# EAGLE design IRRemoteWand (EAGLE 7.6.0)

## Sheet 1 of 2
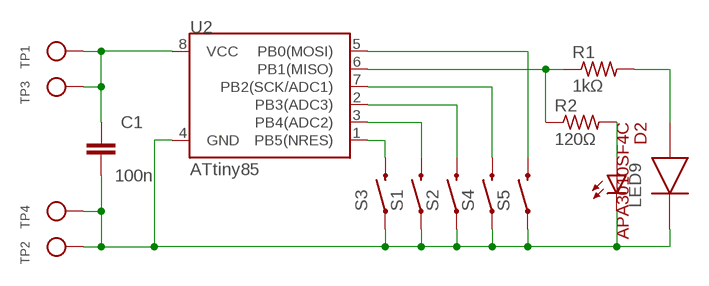
[diagram p0: schematic, sheet 1]

### Parts
C1  100n  CAP0603-CAP  [0603-CAP]
D2  APA3010SF4C  [APA3010SF4C]
LED9  LEDCHIPLED_0805  [CHIPLED_0805]
R1  1kΩ  R-US_M0805  [M0805]
R2  120Ω  R-US_M0805  [M0805]
S1  SWITCH-MOMENTARY-2SMD-4  [TACTILE_SWITCH_TALL]
S2  SWITCH-MOMENTARY-2SMD-4  [TACTILE_SWITCH_TALL]
S3  SWITCH-MOMENTARY-2SMD-4  [TACTILE_SWITCH_TALL]
S4  SWITCH-MOMENTARY-2SMD-4  [TACTILE_SWITCH_TALL]
S5  SWITCH-MOMENTARY-2SMD-4  [TACTILE_SWITCH_TALL]
TP1  TESTPOINTPAD  [TESTPOINT_PAD_2MM]
TP2  TESTPOINTPAD  [TESTPOINT_PAD_2MM]
TP3  TESTPOINTPAD  [TESTPOINT_PAD_2MM]
TP4  TESTPOINTPAD  [TESTPOINT_PAD_2MM]
U2  ATtiny85  ATTINY45TINY45-20-SMT  [SO08-EIAJ]

### Nets
GND: C1.2 D2.2 LED9.C S1.A2 S2.A2 S3.A2 S4.A2 S5.A2 TP2.P$1 TP4.P$1 U2.4(GND)
N$1: R1.1 R2.1 U2.6(PB1(MISO))
N$3: S3.B2 U2.1(PB5(NRES))
N$4: S1.B2 U2.3(PB4(ADC2))
N$5: S2.B2 U2.2(PB3(ADC3))
N$6: S4.B2 U2.7(PB2(SCK/ADC1))
N$7: D2.1 R1.2
N$8: S5.B2 U2.5(PB0(MOSI))
N$9: C1.1 TP1.P$1 TP3.P$1 U2.8(VCC)
N$10: LED9.A R2.2

## Sheet 2 of 2

## Library data of the parts
C1 = SparkFun-Capacitors:CAP: Capacitor Standard 0603 ceramic capacitor, and 0.1" leaded capacitor.
D2 = SparkFun-LED:APA3010SF4C: DIO-10854 Right-angle 880nm SMT infrared LED; PROD_ID: DIO-10854
LED9 = adafruit:LED: LED OSRAM: - CHIPLED LG R971, LG N971, LY N971, LG Q971, LY Q971, LO R971, LY R971 LH N974, LH R974 LS Q976, LO Q976, LY Q976 LO Q996 - Hyper CHIPLED LW Q18S LB Q993, LB Q99A, LB R99A - SideLED LS A670, LO A670, LY A670, LG A670, LP A670 LB A673, LV A673, LT A673, LW A673 LH A674 LY A675 LS A676, LA A676, LO A676, LY A676, LW A676 LS A679, LY A679, LG A679 - Hyper Micro SIDELED® LS Y876, LA Y876, LO Y876, LY Y876 LT Y87S - SmartLED LW L88C, LW L88S LB L89C, LB L89S, LG L890 LS L89K, LO L89K, LY L89K LS L896, LA L896, LO L896, LY L896 - TOPLED LS T670, LO T670, LY T670, LG T670, LP T670 LSG T670, LSP T670, LSY T670, LOP T670, LYG T670 LG T671, LOG T671, LSG T671 LB T673, LV T673, LT T673, LW T673 LH T674 LS T676, LA T676, LO T676, LY T676, LB T676, LH T676, LSB T676, LW T676 LB T67C, LV T67C, LT T67C, LS T67K, LO T67K, LY T67K, LW E67C LS E67B, LA E67B, LO E67B, LY E67B, LB E67C, LV E67C, LT E67C LW T67C LS T679, LY T679, LG T679 LS T770, LO T770, LY T770, LG T770, LP T770 LB T773, LV T773, LT T773, LW T773 LH T774 LS E675, LA E675, LY E675, LS T675 LS T776, LA T776, LO T776, LY T776, LB T776 LHGB T686 LT T68C, LB T68C - Hyper Mini TOPLED® LB M676 - Mini TOPLED Santana® LG M470 LS M47K, LO M47K, LY M47K Source: http://www.osram.convergy.de/
R1 R2 = adafruit:R-US_: RESISTOR, American symbol
S1-S5 = SparkFun-Electromechanical:SWITCH-MOMENTARY-2: Various NO switches- pushbuttons, reed, etc; PROD_ID: SWCH-11966
TP1-TP4 = microbuilder:TESTPOINT: Test Point Various test points for characterisation and PCB testing TESTPOINT_SMT - Compact Surface Mount Test Point [Digikey: 5016KTR-ND]
U2 = SparkFun-DigitalIC:ATTINY45: Atmel 8-pin 2/4/8kB flash uC; PROD_ID: IC-08922; VALUE: Tiny45-20-SMT

## Board
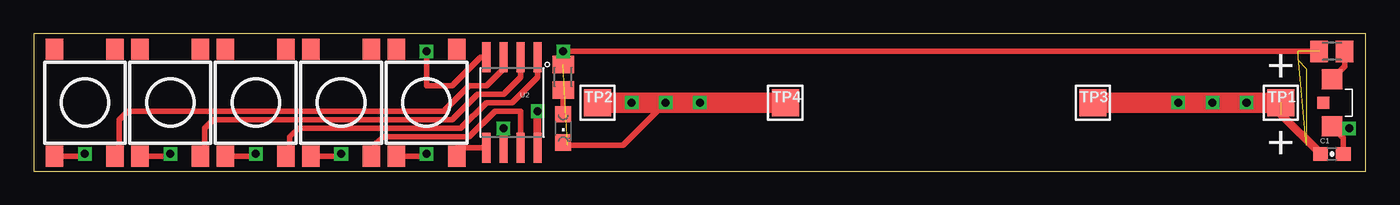
[diagram p1: board, top side]
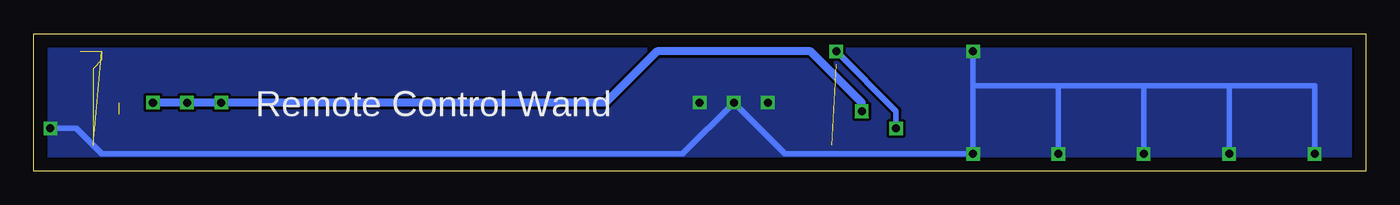
[diagram p2: board, bottom side, seen from below]

Size 99.04 x 10.21 mm. Coordinates in mm from the lower left corner, seen from the top.
Outline: 0,0 99.04,0 99.04,10.21 0,10.21 0,0
Copper layers (1*16): Top 0.035mm / dielectric 1.5mm / Bottom 0.035mm
Design rules "default": minimum track width 10mil, minimum drill 24mil, track to track 8mil, track to pad 8mil, pad to pad 8mil, via to via 8mil, smd to smd 8mil, copper to edge 40mil, drill to drill 8mil, minimum pad ring 10mil, minimum via ring 8mil, stop-mask expansion 4mil, vias tented up to drill 0mil, thermal gap 10mil

### Footprints (pad centres in the part's own frame; a part is rotated, then mirrored left to right if it is on the bottom)
0603-CAP = smd 1.1 x 1: 1 -0.85,0; 2 0.85,0
APA3010SF4C = smd 1.5 x 1.5: 1 0,-1.75; 2 0,1.75 | smd 0.9 x 0.9: 3 0.65,0
CHIPLED_0805 = smd 1.2 x 1.2: A 0,-1.05; C 0,1.05
M0805 = smd 1.3 x 1.6: 1 -0.95,0; 2 0.95,0
TACTILE_SWITCH_TALL = smd 1.55 x 1.3: A1 -3.975,-2.25; A2 3.975,-2.25; B1 -3.975,2.25; B2 3.975,2.25
TESTPOINT_PAD_2MM = smd 2 x 2: P$1 0,0
SO08-EIAJ = smd 0.61 x 2.21: 1 -1.905,-3.378; 2 -0.635,-3.378; 3 0.635,-3.378; 4 1.905,-3.378; 5 1.905,3.353; 6 0.635,3.353; 7 -0.635,3.353; 8 -1.905,3.353

### Placement (x,y rotation side)
C1  96.52,1.27 0 top
D2  96.52,5.08 180 top
LED9  39.37,3.17 180 top
R1  96.52,8.89 0 top
R2  39.37,6.99 270 top
S1  3.81,5.08 270 top
S2  10.16,5.08 270 top
S3  16.51,5.08 270 top
S4  22.86,5.08 270 top
S5  29.21,5.08 270 top
TP1  92.71,5.08 0 top
TP2  41.91,5.08 0 top
TP3  78.74,5.08 0 top
TP4  55.88,5.08 0 top
U2  35.56,5.08 180 top

### Tracks (layer width: path | path; a pad name or v marks a point on that pad's centre or on a via)
GND  (via drill 0.6)
  Top 0.406: S4.A2 22.7,1.1 v22.86,1.27 | S3.A2 16.34,1.1 v16.51,1.27 | S2.A2 9.99,1.1 v10.16,1.27 | S1.A2 3.65,1.1 v3.81,1.27 | U2.4 33.22,8.46 31.11,6.35 29.21,6.35 v29.21,8.89 | 39.37,2.54 LED9.C 39.59,1.91 43.81,1.91 v46.99,5.08 | S5.A2 29.05,1.1 v29.21,1.27 | D2.2 97.37,2.48 C1.2 | D2.2 96.52,3.81 | D2.2 96.52,3.17 v97.79,3.17
  Top 1.524: TP2.P$1 v44.45,5.08 v46.99,5.08 v49.53,5.08 TP4.P$1
  Bottom 0.406: v22.86,1.27 22.86,6.35 | 22.86,6.35 29.21,6.35 | v16.51,1.27 16.51,6.35 | 16.51,6.35 22.86,6.35 | v10.16,1.27 10.16,6.35 | 10.16,6.35 16.51,6.35 | v3.81,1.27 3.81,6.35 10.16,6.35 | v29.21,8.89 29.21,6.35 | 29.21,6.35 v29.21,1.27 43.18,1.27 v46.99,5.08 50.8,1.27 93.98,1.27 95.89,3.17 v97.79,3.17
  pour Bottom: 0,10.16 99.06,10.16 99.06,0 0,0
N$1  (via drill 0.6)  (6 unrouted)
  Top 0.406: U2.6 v34.92,3.17 | R2.1 v39.37,8.89 R1.1
  Bottom 0.406: v34.92,3.17 34.92,4.45 v39.37,8.89
N$3
  Top 0.406: U2.1 37.47,6.99 35.56,5.08 33.66,5.08 31.75,3.17 19.68,3.17 19.05,2.54 19.05,1.4 S3.B2
N$4
  Top 0.406: U2.3 34.92,7.62 33.66,6.35 32.38,6.35 30.48,4.45 6.99,4.45 6.35,3.81 6.35,1.4 S1.B2
N$5
  Top 0.406: U2.2 36.2,6.99 34.92,5.71 33.02,5.71 31.11,3.81 13.34,3.81 12.7,3.17 12.7,1.4 S2.B2
N$6
  Top 0.406: U2.7 36.2,4.45 34.29,4.45 32.38,2.54 26.04,2.54 25.4,2.03 25.4,1.4 S4.B2
N$7
  Top 0.406: R1.2 97.47,7.78 D2.1
N$8
  Top 0.406: U2.5 31.46,1.73 S5.B2
N$9  (via drill 0.6)  (1 unrouted)
  Top 0.61: U2.8 v37.47,4.45 | C1.1 92.71,4.23
  Top 1.524: TP1.P$1 v87.63,5.08 v90.17,5.08 v85.09,5.08 TP3.P$1
  Bottom 0.61: v37.47,4.45 37.47,5.08 41.27,8.89 52.7,8.89 56.52,5.08 v85.09,5.08 v90.17,5.08
N$10
  Top 0.406: R2.2 LED9.A

### Text on the board
tPlace: + | +
bPlace: Remote Control Wand